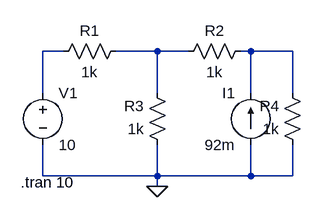
[diagram p0: schematic Draft1.asc]
Draft1.asc, the LTspice schematic file:
Version 4
SHEET 1 880 680
WIRE 96 80 64 80
WIRE 240 80 176 80
WIRE 288 80 240 80
WIRE 384 80 368 80
WIRE 448 80 384 80
WIRE 64 144 64 80
WIRE 240 144 240 80
WIRE 384 144 384 80
WIRE 448 144 448 80
WIRE 64 272 64 224
WIRE 240 272 240 224
WIRE 240 272 64 272
WIRE 384 272 384 224
WIRE 384 272 240 272
WIRE 448 272 448 224
WIRE 448 272 384 272
WIRE 240 288 240 272
FLAG 240 288 0
SYMBOL res 192 64 R90
WINDOW 0 0 56 VBottom 2
WINDOW 3 32 56 VTop 2
SYMATTR InstName R1
SYMATTR Value 1k
SYMBOL res 384 64 R90
WINDOW 0 0 56 VBottom 2
WINDOW 3 32 56 VTop 2
SYMATTR InstName R2
SYMATTR Value 1k
SYMBOL res 256 240 R180
WINDOW 0 36 76 Left 2
WINDOW 3 36 40 Left 2
SYMATTR InstName R3
SYMATTR Value 1k
SYMBOL res 464 240 R180
WINDOW 0 36 76 Left 2
WINDOW 3 36 40 Left 2
SYMATTR InstName R4
SYMATTR Value 1k
SYMBOL voltage 64 128 R0
WINDOW 123 0 0 Left 2
WINDOW 39 0 0 Left 2
SYMATTR InstName V1
SYMATTR Value 10
SYMBOL current 384 224 R180
WINDOW 0 24 80 Left 2
WINDOW 3 24 0 Left 2
WINDOW 123 0 0 Left 2
WINDOW 39 0 0 Left 2
SYMATTR InstName I1
SYMATTR Value 92m
TEXT 30 282 Left 2 !.tran 10

The netlist it stands for:
* Draft1.asc
R1 N002 N001 1k
R2 N003 N002 1k
R3 0 N002 1k
R4 0 N003 1k
V1 N001 0 10
I1 0 N003 92m
.tran 10
.backanno
.end